# Altium project PCB_Project2.PrjPCB
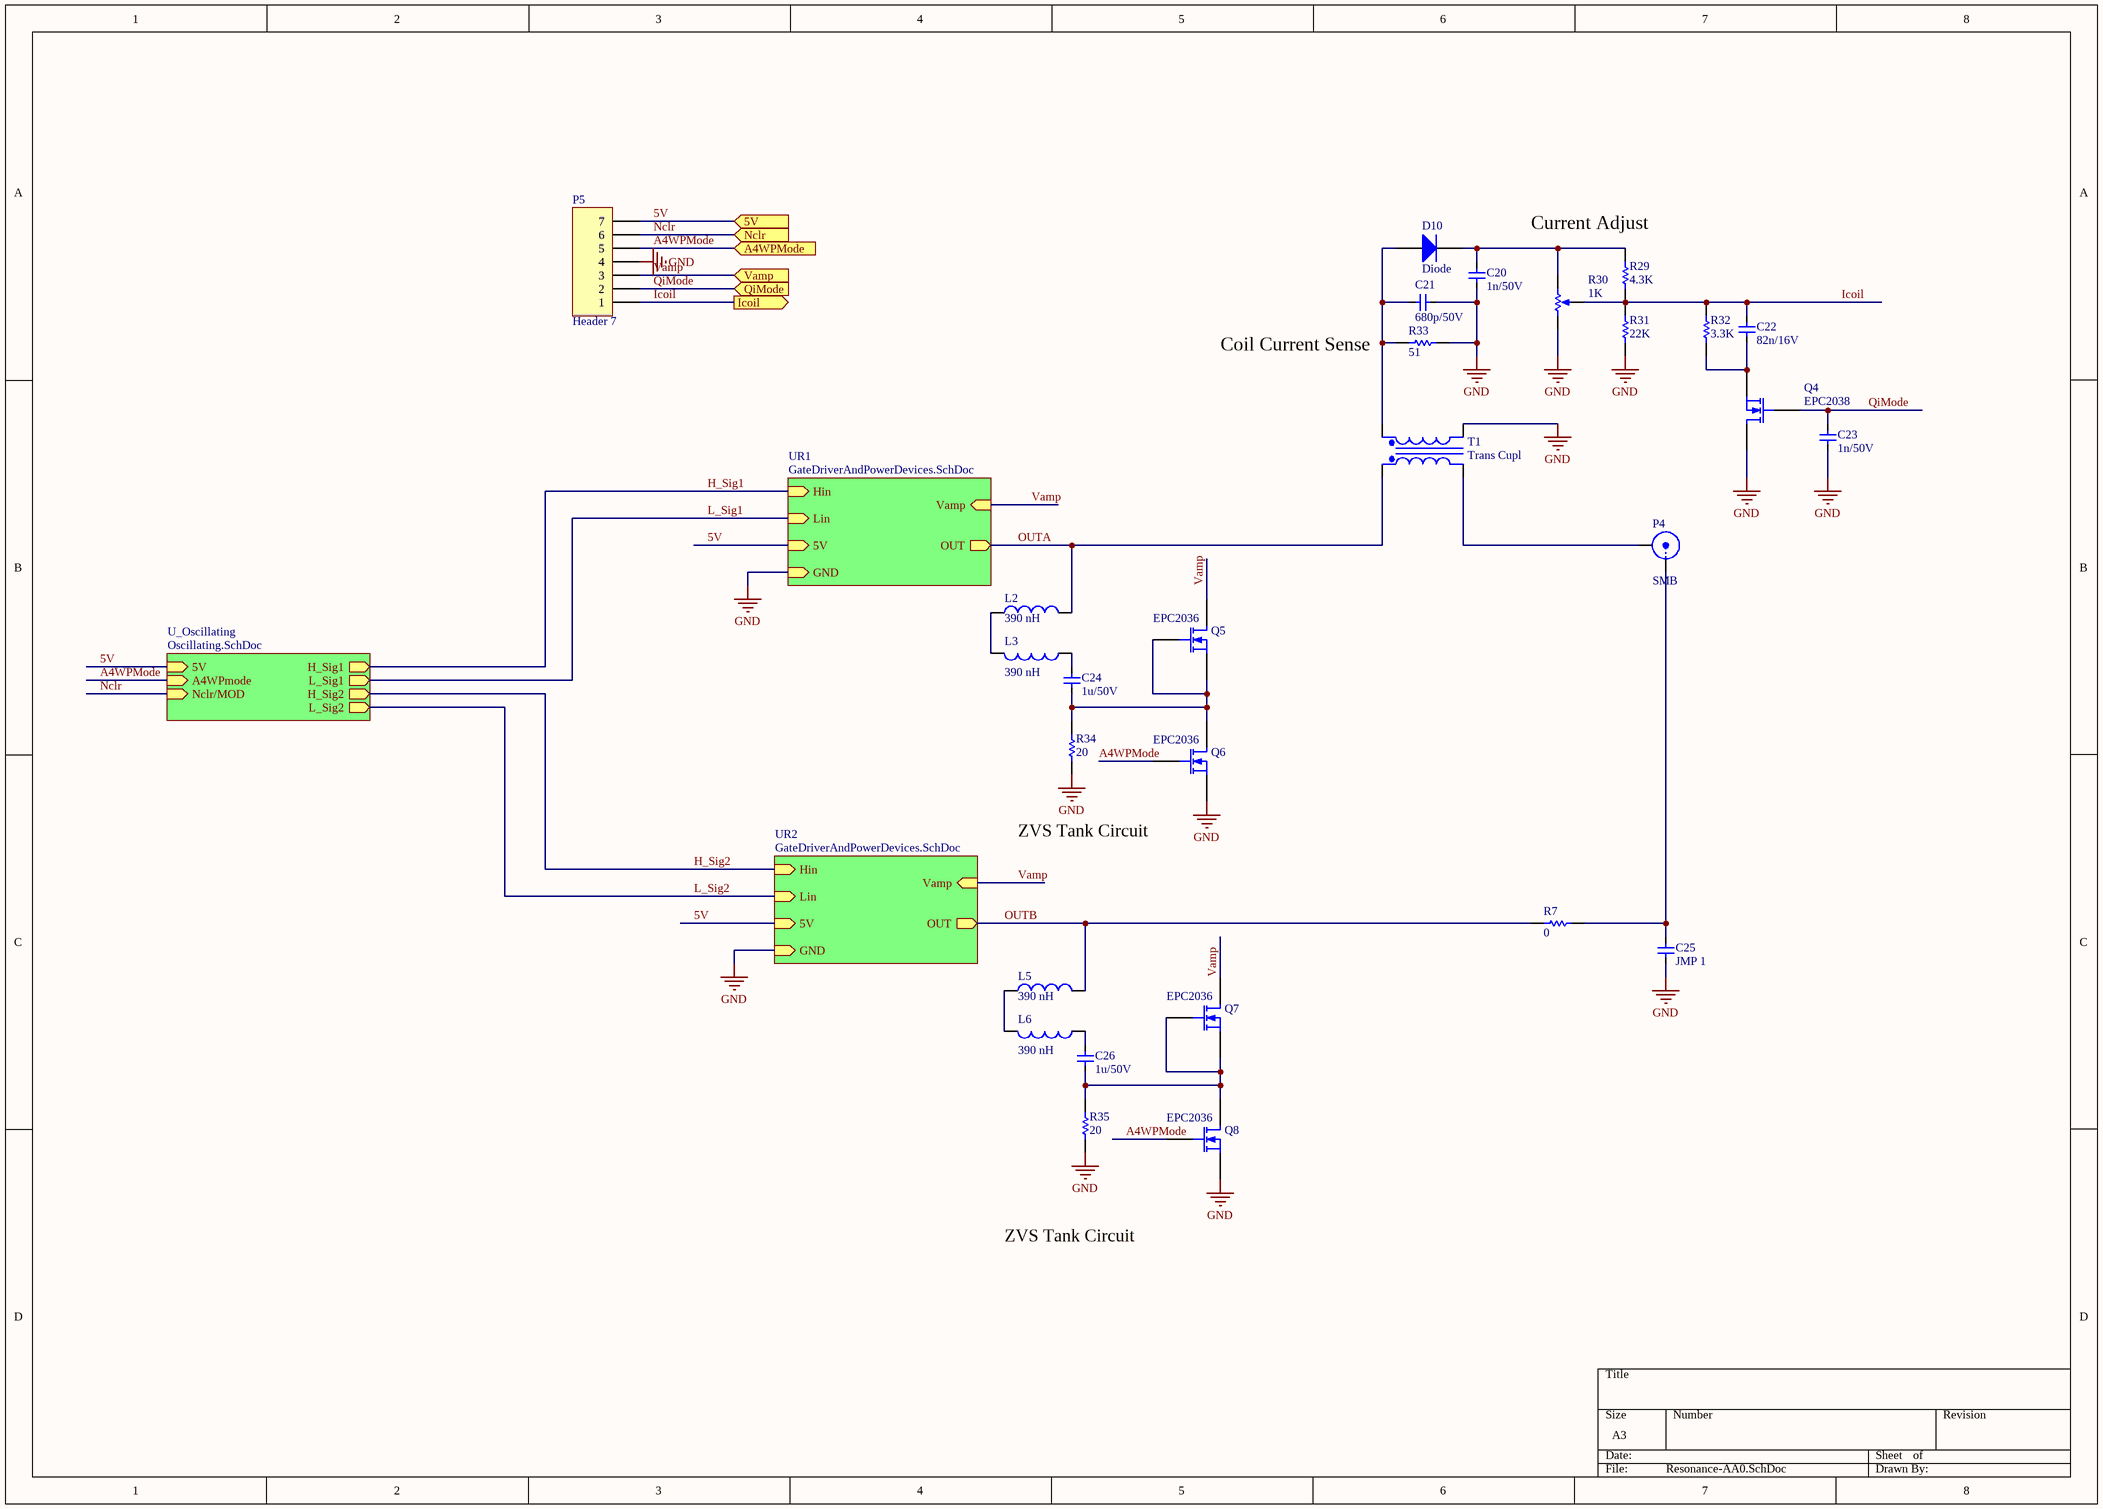
[diagram p0: Resonance-AA0.SchDoc]
8 sheets, 243 parts. Net scope: hierarchical (ports join the sheet entries above them; power ports are global).
Board file: A4WP-PCB.PcbDoc
Sheets:
  Resonance-AA0.SchDoc
    UR1 = GateDriverAndPowerDevices.SchDoc
    UR2 = GateDriverAndPowerDevices.SchDoc
    U_Oscillating = Oscillating.SchDoc
  top.SchDoc
    U_PowerSupport = PowerSupport.SchDoc
    U_ControlManage = ControlManage.SchDoc
    U_ControlPower = ControlPower.SchDoc
  MeasurevoltageCurrent .SchDoc

## Sheet Resonance-AA0.SchDoc
size A3

### Parts
(Parts that share a designator on the sheet are numbered #1, #2 ... from top to bottom, then left to right.)
C20  1n/50V  [0603]
C21  680p/50V  [0603]
C22  82n/16V  [0603]
C23  1n/50V  [0603]
C24  1u/50V  [0603]
C25#1  JMP 1  [0603]
C26#1  1u/50V  [0603]
D10#1  Diode  [SMA]
L2#1  value 390 nH  [INDP12274X23N]  (hidden comment: Inductor)
L3  value 390 nH  [INDP12274X23N]  (hidden comment: Inductor)
L5  value 390 nH  [INDP12274X23N]  (hidden comment: Inductor)
L6  value 390 nH  [INDP12274X23N]  (hidden comment: Inductor)
P4  SMB  [CONSMA003.062]
P5  Header 7  [HDR1X7]
Q4  EPC2038  [BGA100P9X9-81A]
Q5#1  EPC2036  [BGA100P9X9-81A]
Q6#1  EPC2036  [BGA100P9X9-81A]
Q7#1  EPC2036  [BGA100P9X9-81A]
Q8  EPC2036  [BGA100P9X9-81A]
R7#1  value 0  [0603]  (hidden comment: Res1)
R29  value 4.3K  [0603]  (hidden comment: Res1)
R30  value 1K  [VR5]  (hidden comment: RPot)
R31  value 22K  [0603]  (hidden comment: Res1)
R32  value 3.3K  [0603]  (hidden comment: Res1)
R33  value 51  [0603]  (hidden comment: Res1)
R34#1  value 20  [0603]  (hidden comment: Res1)
R35#1  value 20  [0603]  (hidden comment: Res1)
T1#1  Trans Cupl  [SOIC127P590X175-4N]

### Sub-sheets
U_Oscillating = Oscillating.SchDoc: 5V (in), H_Sig1 (out), L_Sig1 (out), H_Sig2 (out), L_Sig2 (out), A4WPmode (in), Nclr/MOD (in)
UR1 = GateDriverAndPowerDevices.SchDoc: 5V (in), OUT (out), Hin (in), Lin (in), GND (in), Vamp (in)
UR2 = GateDriverAndPowerDevices.SchDoc: 5V (in), OUT (out), Hin (in), Lin (in), GND (in), Vamp (in)

### Ports
5V (in), A4WPMode (in), Icoil (out), Nclr (in), QiMode (in), Vamp (in)

### Nets
GND: C20.1 C21.2 C23.1 C25#1.2 P5.4 Q4.1(D) Q6#1.3(S) Q8.3(S) R30.1(TOP) R31.2 R33.1 R34#1.1 R35#1.1 T1#1.2(Pri-) ; sheet UR1/GND, sheet UR2/GND
5V: P5.7 ; port 5V, sheet UR1/5V, sheet UR2/5V, sheet U_Oscillating/5V
A4WPMode: P5.5 Q6#1.2(G) Q8.2(G) ; port A4WPMode, sheet U_Oscillating/A4WPmode
H_Sig1: sheet UR1/Hin, sheet U_Oscillating/H_Sig1
H_Sig2: sheet UR2/Hin, sheet U_Oscillating/H_Sig2
Icoil: C22.2 P5.1 R29.2 R30.3(TAP) R31.1 R32.1 ; port Icoil
L_Sig1: sheet UR1/Lin, sheet U_Oscillating/L_Sig1
L_Sig2: sheet UR2/Lin, sheet U_Oscillating/L_Sig2
Nclr: P5.6 ; port Nclr, sheet U_Oscillating/Nclr/MOD
OUTA: L2#1.2 T1#1.3(Sec+) ; sheet UR1/OUT  [project net OUT]
OUTB: L5.2 R7#1.1 ; sheet UR2/OUT  [project net OUT]
QiMode: C23.2 P5.2 Q4.2(G) ; port QiMode
Vamp: P5.3 Q5#1.1(D) Q7#1.1(D) ; port Vamp, sheet UR1/Vamp, sheet UR2/Vamp
NetC20_2: C20.2 D10#1.2(K) R29.1 R30.2(BOT)
NetC21_1: C21.1 D10#1.1(A) R33.2 T1#1.1(Pri+)
NetC22_1: C22.1 Q4.3(S) R32.2
NetC24_1: C24.1 L3.1
NetC24_2: C24.2 Q5#1.2(G) Q5#1.3(S) Q6#1.1(D) R34#1.2
NetC25#1_1: C25#1.1 P4.1(X) R7#1.2
NetC26#1_1: C26#1.1 L6.1
NetC26#1_2: C26#1.2 Q7#1.2(G) Q7#1.3(S) Q8.1(D) R35#1.2
NetL2#1_1: L2#1.1 L3.2
NetL5_1: L5.1 L6.2
NetP4_2: P4.2(Y) T1#1.4(Sec-)

### Notes on the sheet
- (near R29) Current Adjust
- (near R33) Coil Current Sense
- ZVS Tank Circuit

### Library data of the parts
C20-C24 C25#1 C26#1 = CAP1: Capacitor
D10#1 = Diode: Default Diode; Published: 8-Jun-2000; LatestRevisionDate: 17-Jul-2002; LatestRevisionNote: Re-released for DXP Platform.; PackageVersion: Sep-1996; PackageReference: SMC; Publisher: Altium Limited; PackageDescription: DO-214-AB/SMC; 2 C-Bend Leads; Body 7.9 x 5.9 mm, inc. leads (LxW); Code_JEDEC: DO-214-AB
L2#1 L3 L5 L6 = Inductor: Code_IEC: 1005; Published: 8-Jun-2000; LatestRevisionDate: 29-May-2009; LatestRevisionNote: IPC-7351 Footprint Added.; PackageReference: 0402-A; Publisher: Altium Limited; PackageDescription: Chip Inductor; Code_JEITA: 0402
P4 = SMB: SMB Straight Connector; LatestRevisionDate: 17-Jul-2002; LatestRevisionNote: Re-released for DXP Platform.; Publisher: Altium Limited
P5 = Header 7: Header, 7-Pin; LatestRevisionDate: 17-Jul-2002; LatestRevisionNote: Re-released for DXP Platform.; Publisher: Altium Limited
Q4 Q5#1 Q6#1 Q7#1 Q8 = MOSFET-N: N-Channel MOSFET; Published: 8-Jun-2000; LatestRevisionDate: 17-Jul-2002; LatestRevisionNote: Re-released for DXP Platform.; PackageVersion: 1995/1996; PackageReference: E3; Publisher: Altium Limited; PackageDescription: TO, Flat Index; 3 In-Line, Axial Leads; Body Dia. 4.6mm; Lead Dia. 0.5 mm (max)
R7#1 R29 R31-R33 R34#1 R35#1 = Res1: Resistor; Published: 8-Jun-2000; LatestRevisionDate: 17-Jul-2002; LatestRevisionNote: Re-released for DXP Platform.; PackageReference: AXIAL-0.3; Publisher: Altium Limited; PackageDescription: Axial Device, Thru-Hole; 2 Leads; 0.3 in Pin Spacing
R30 = RPot: Potentiometer; Sim Note: Enter the Resistance value and the set point into parameter fields.; Set Position: 0.5; Published: 8-Jun-2000; LatestRevisionDate: 17-Jul-2002; LatestRevisionNote: Re-released for DXP Platform.; PackageReference: VR5; Publisher: Altium Limited; PackageDescription: Variable Resistor, Thru-Hole; 3 Leads
T1#1 = Trans Cupl: Transformer (Coupled Inductor Model); Published: 8-Jun-2000; LatestRevisionDate: 17-Jul-2002; LatestRevisionNote: Re-released for DXP Platform.; PackageReference: TRF_4; Publisher: Altium Limited; PackageDescription: Transformer; 4 Leads

## Sheet GateDriverAndPowerDevices.SchDoc: Gate driver and power devices schematic
size A4
Used 2 times, as channels UR1, UR2. Parts and nets are listed once, with the designators drawn on the sheet.
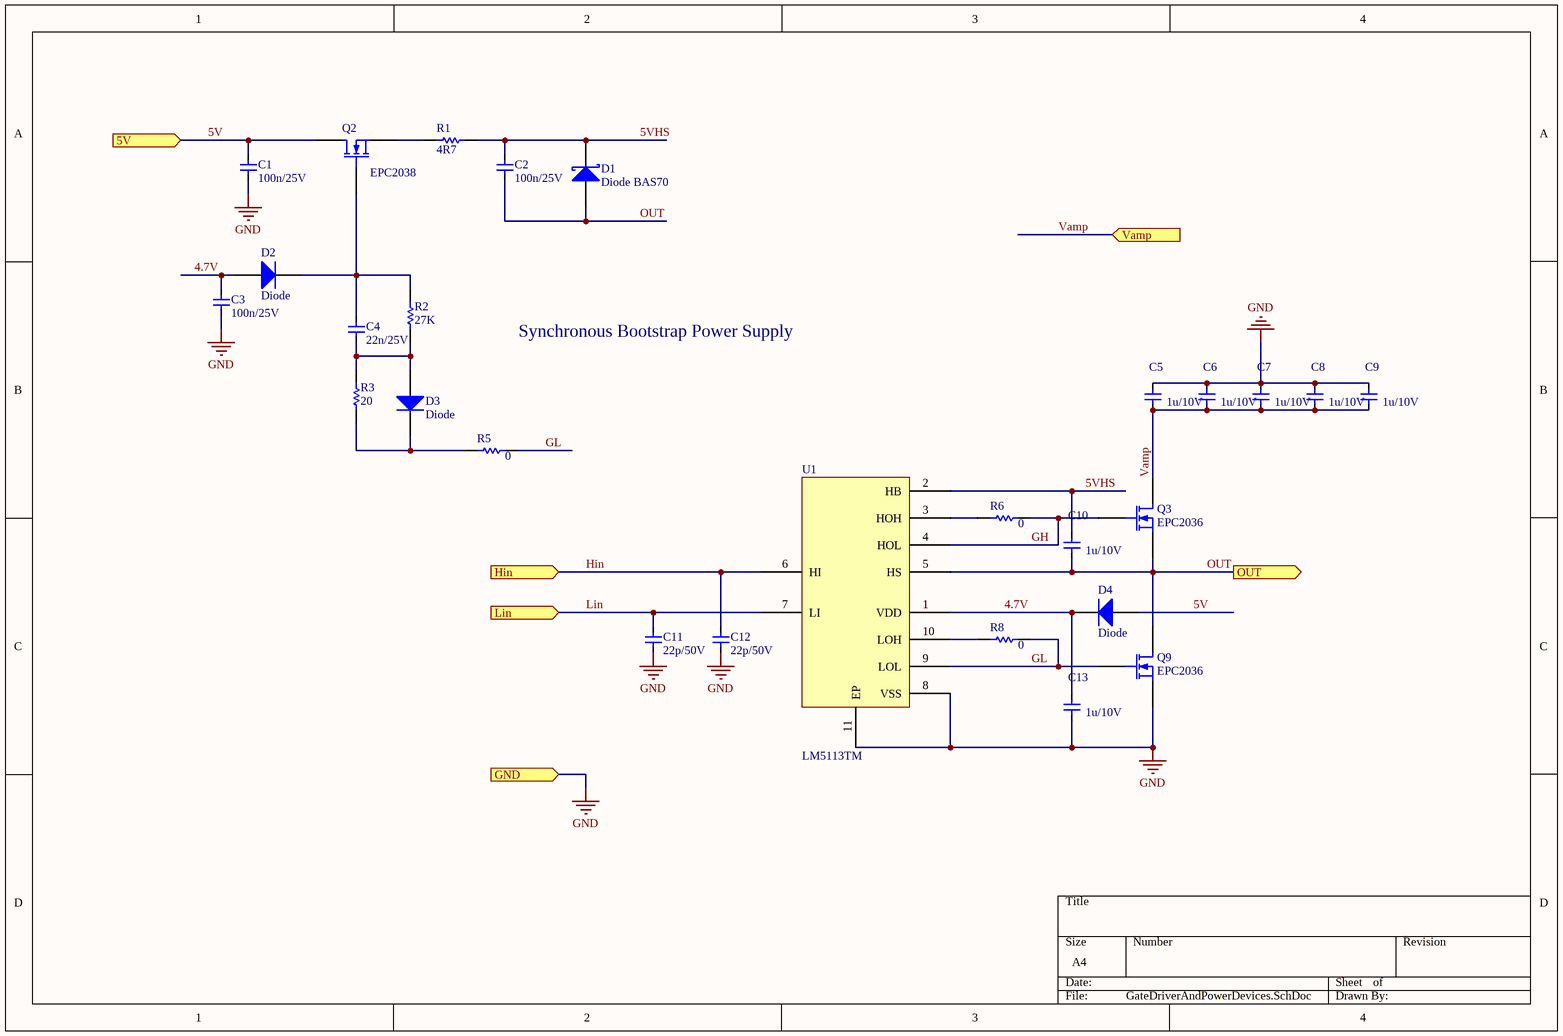
[diagram p1: GateDriverAndPowerDevices.SchDoc]

### Parts
C1  100n/25V  [0603]
C2  100n/25V  [0603]
C3  100n/25V  [0603]
C4  22n/25V  [0603]
C5  1u/10V  [0603]
C6  1u/10V  [0603]
C7  1u/10V  [0603]
C8  1u/10V  [0603]
C9  1u/10V  [0603]
C10  1u/10V  [0603]
C11  22p/50V  [0603]
C12  22p/50V  [0603]
C13  1u/10V  [0603]
D1  Diode BAS70  [SMA]
D2  Diode  [SMA]
D3  Diode  [SMA]
D4  Diode  [SMA]
Q2  EPC2038  [BGA100P9X9-81A]
Q3  EPC2036  [BGA100P9X9-81A]
Q9  EPC2036  [BGA100P9X9-81A]
R1  value 4R7  [0603]  (hidden comment: Res1)
R2  value 27K  [0603]  (hidden comment: Res1)
R3  value 20  [0603]  (hidden comment: Res1)
R5  value 0  [0603]  (hidden comment: Res1)
R6  value 0  [0402]  (hidden comment: Res1)
R8  value 0  [0402]  (hidden comment: Res1)
U1  LM5113TM  [QFN80P400X400X80-10N]

### Ports
5V (in), GND (in), Hin (in), Lin (in), OUT (out), Vamp (in)

### Nets
GND: C1.2 C3.2 C5.1 C6.1 C7.1 C8.1 C9.1 C11.2 C12.2 C13.2 Q9.3(S) U1.8(VSS) U1.11(EP) ; port GND
4.7V: C3.1 C13.1 D2.1(A) D4.2(K) U1.1(VDD)
5V: C1.1 D4.1(A) Q2.1(D) ; port 5V
5VHS: C2.1 C10.1 D1.3(K) R1.1 U1.2(HB)
GH: Q3.2(G) R6.2 U1.4(HOL)
GL: Q9.2(G) R5.2 R8.2 U1.9(LOL)
Hin: C12.1 U1.6(HI) ; port Hin
Lin: C11.1 U1.7(LI) ; port Lin
OUT: C2.2 C10.2 D1.1(A) Q3.3(S) Q9.1(D) U1.5(HS) ; port OUT
Vamp: C5.2 C6.2 C7.2 C8.2 C9.2 Q3.1(D) ; port Vamp
NetC4_1: C4.1 D2.2(K) Q2.2(G) R2.2
NetC4_2: C4.2 D3.1(A) R2.1 R3.2
NetD3_2: D3.2(K) R3.1 R5.1
NetQ2_3: Q2.3(S) R1.2
NetR6_1: R6.1 U1.3(HOH)
NetR8_1: R8.1 U1.10(LOH)

### Channels
UR1: designators end in _UR1; ports 5V=5V GND=GND Hin=H_Sig1 Lin=L_Sig1 OUT=OUT Vamp=Vamp
UR2: designators end in _UR2; ports 5V=5V GND=GND Hin=H_Sig2 Lin=L_Sig2 OUT=OUT Vamp=Vamp

### Notes on the sheet
- Synchronous Bootstrap Power Supply

### Library data of the parts
C1-C13 = CAP1: Capacitor
D1 = Diode BAS70: Silicon AF Schottky Diode for High-Speed Switching; pin to pad: 3>2; Note: Pin 2 is not connected and not drawn.; Published: 21-Mar-2003; LatestRevisionDate: 29-May-2009; LatestRevisionNote: IPC-7351 Footprint Added.; DatasheetVersion: Oct-1999; PackageVersion: Sep-2001; PackageReference: SOT-23; Publisher: Altium Limited; PackageDescription: 3-Pin SOT-23 Package 0.95 mm Pitch, 2.5 mm Lead Span; ComponentLink1Description: Manufacturer Link; ComponentLink1URL: http://www.infineon.com/; ComponentLink2Description: Datasheet; ComponentLink2URL: http://www.infineon.com/upload/Document/cmc_upload/documents/009/382/bas40_bas140series_1.pdf
D2-D4 = Diode: Default Diode; Published: 8-Jun-2000; LatestRevisionDate: 17-Jul-2002; LatestRevisionNote: Re-released for DXP Platform.; PackageVersion: Sep-1996; PackageReference: SMC; Publisher: Altium Limited; PackageDescription: DO-214-AB/SMC; 2 C-Bend Leads; Body 7.9 x 5.9 mm, inc. leads (LxW); Code_JEDEC: DO-214-AB
Q2 Q3 Q9 = MOSFET-N: N-Channel MOSFET; Published: 8-Jun-2000; LatestRevisionDate: 17-Jul-2002; LatestRevisionNote: Re-released for DXP Platform.; PackageVersion: 1995/1996; PackageReference: E3; Publisher: Altium Limited; PackageDescription: TO, Flat Index; 3 In-Line, Axial Leads; Body Dia. 4.6mm; Lead Dia. 0.5 mm (max)
R1-R3 R5 R6 R8 = Res1: Resistor; Published: 8-Jun-2000; LatestRevisionDate: 17-Jul-2002; LatestRevisionNote: Re-released for DXP Platform.; PackageReference: AXIAL-0.3; Publisher: Altium Limited; PackageDescription: Axial Device, Thru-Hole; 2 Leads; 0.3 in Pin Spacing

## Sheet Oscillating.SchDoc
size A3
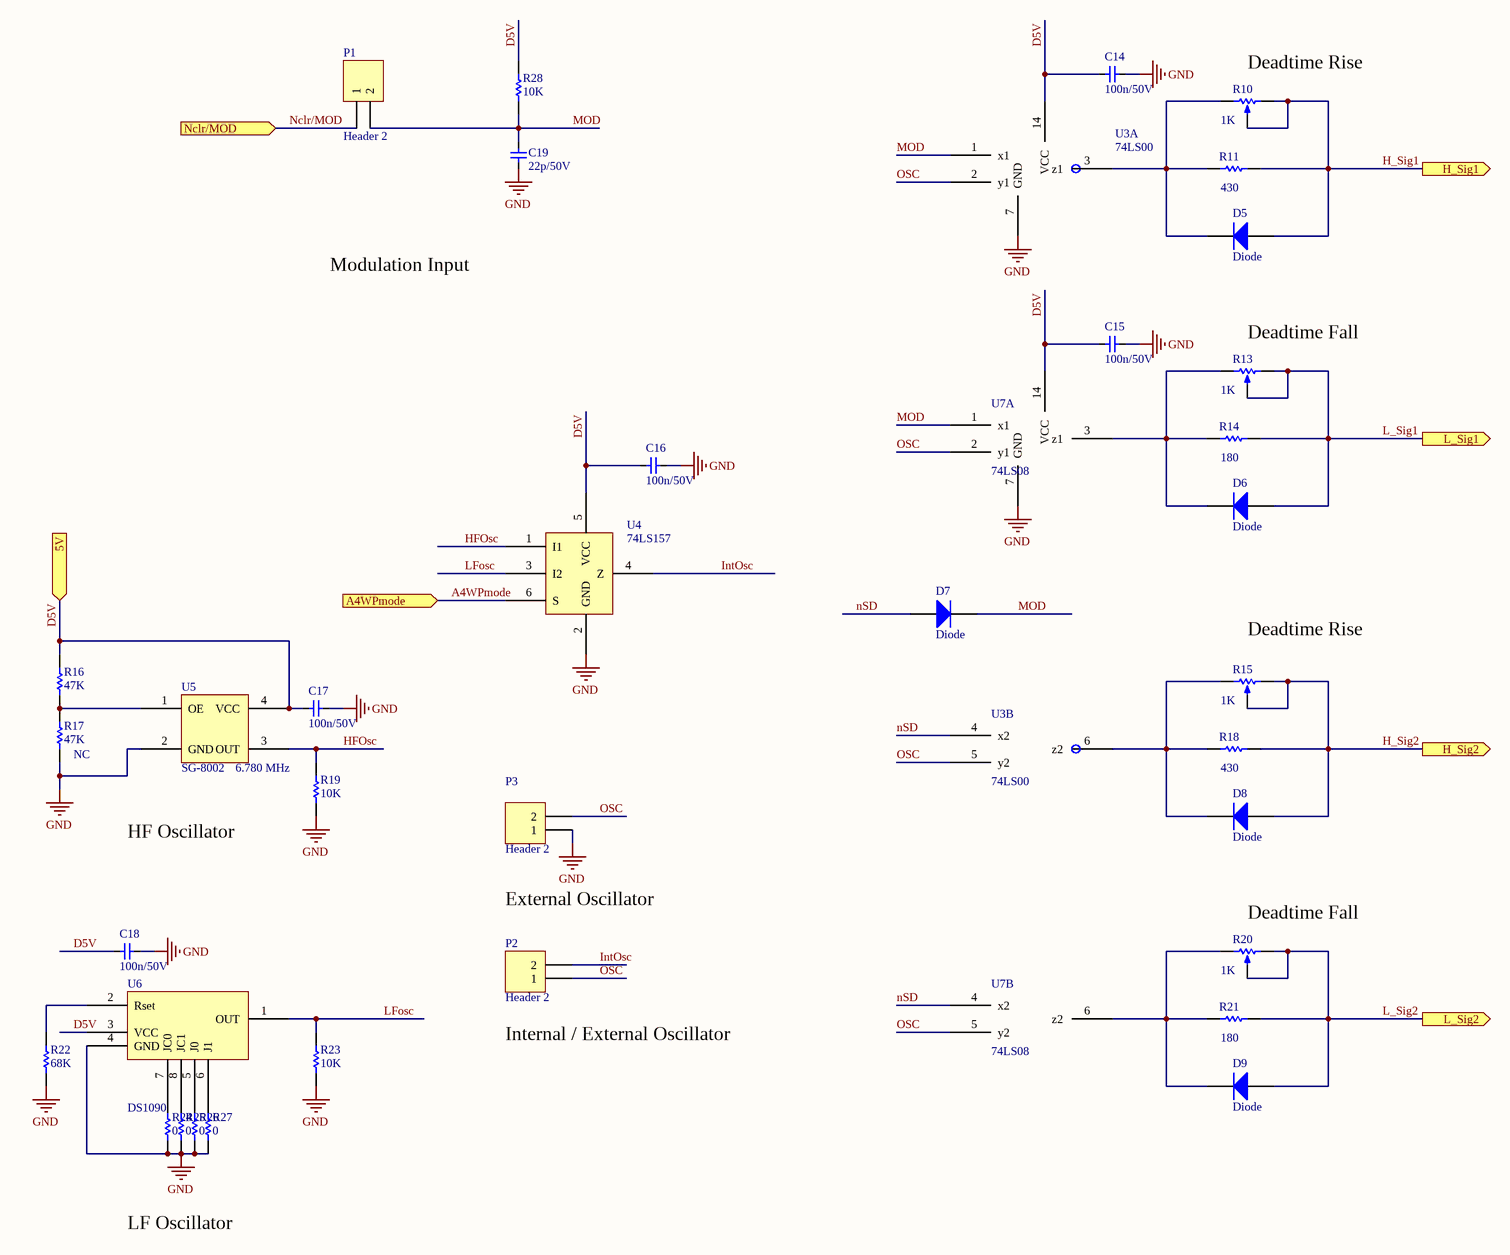
[diagram p2: Oscillating.SchDoc]

### Parts
(Parts that share a designator on the sheet are numbered #1, #2 ... from top to bottom, then left to right.)
C14  100n/50V  [0603]
C15  100n/50V  [0603]
C16  100n/50V  [0603]
C17  100n/50V  [0603]
C18  100n/50V  [0603]
C19  22p/50V  [0603]
D5#1  Diode  [SMA]
D6#1  Diode  [SMA]
D7#1  Diode  [SMA]
D8#1  Diode  [SMA]
D9#1  Diode  [SMA]
P1#1  Header 2  [HDR1X2]
P2#1  Header 2  [HDR1X2]
P3  Header 2  [HDR1X2]
R10#1  value 1K  [VR5]  (hidden comment: RPot)
R11#1  value 430  [0603]
R13#1  value 1K  [VR5]  (hidden comment: RPot)
R14#1  value 180  [0603]
R15#1  value 1K  [VR5]  (hidden comment: RPot)
R16#1  value 47K  [0603]  (hidden comment: Res1)
R17#1  NC  value 47K  [0603]
R18#1  value 430  [0603]
R19#1  value 10K  [0603]  (hidden comment: Res1)
R20#1  value 1K  [VR5]  (hidden comment: RPot)
R21#1  value 180  [0603]
R22#1  value 68K  [0603]
R23#1  value 10K  [0603]  (hidden comment: Res1)
R24#1  value 0  [0603]
R25  value 0  [0603]
R26  value 0  [0603]
R27  value 0  [0603]
R28  value 10K  [0603]  (hidden comment: Res1)
U3#1  74LS00  [SO-14]  (parts A,B of 4)
U4  74LS157  [TSOP65P220X100-6N]
U5#1  SG-8002  value 6.780 MHz  [SOT192P240X120-4N]
U6#1  DS1090  [TSOP65P490X100-8N]
U7  74LS08  [SO-14]  (parts A,B of 4)

### Ports
5V (in), A4WPmode (in), H_Sig1 (out), H_Sig2 (out), L_Sig1 (out), L_Sig2 (out), Nclr/MOD (in)

### Nets
GND: C14.1 C15.1 C16.1 C17.1 C18.1 C19.2 P3.1 R17#1.1 R19#1.1 R22#1.1 R23#1.1 R24#1.1 R25.1 R26.1 R27.1 U3#1.7(GND) U4.2(GND) U5#1.2(GND) U6#1.4(GND) U7.7(GND)
A4WPMode: U4.6(S) ; port A4WPmode
D5V: C14.2 C15.2 C16.2 C17.2 C18.2 R16#1.2 R28.2 U3#1.14(VCC) U4.5(VCC) U5#1.4(VCC) U6#1.3(VCC) U7.14(VCC) ; port 5V  [project net 5V]
H_Sig1: D5#1.1(A) R10#1.2(BOT) R10#1.3(TAP) R11#1.1 ; port H_Sig1
H_Sig2: D8#1.1(A) R15#1.2(BOT) R15#1.3(TAP) R18#1.1 ; port H_Sig2
HFOsc: R19#1.2 U4.1(I1) U5#1.3(OUT)
IntOsc: P2#1.2 U4.4(Z)
L_Sig1: D6#1.1(A) R13#1.2(BOT) R13#1.3(TAP) R14#1.1 ; port L_Sig1
L_Sig2: D9#1.1(A) R20#1.2(BOT) R20#1.3(TAP) R21#1.1 ; port L_Sig2
LFosc: R23#1.2 U4.3(I2) U6#1.1(OUT)
MOD: C19.1 D7#1.2(K) P1#1.2 R28.1 U3#1.1(x1) U7.1(x1)
Nclr/MOD: P1#1.1 ; port Nclr/MOD  [project net Nclr]
nSD: D7#1.1(A) U3#1.4(x2) U7.4(x2)
OSC: P2#1.1 P3.2 U3#1.2(y1) U3#1.5(y2) U7.2(y1) U7.5(y2)
NetD5#1_2: D5#1.2(K) R10#1.1(TOP) R11#1.2 U3#1.3(z1)
NetD6#1_2: D6#1.2(K) R13#1.1(TOP) R14#1.2 U7.3(z1)
NetD8#1_2: D8#1.2(K) R15#1.1(TOP) R18#1.2 U3#1.6(z2)
NetD9#1_2: D9#1.2(K) R20#1.1(TOP) R21#1.2 U7.6(z2)
NetR16#1_1: R16#1.1 R17#1.2 U5#1.1(OE)
NetR22#1_2: R22#1.2 U6#1.2(Rset)
NetR24#1_2: R24#1.2 U6#1.7(JC0)
NetR25_2: R25.2 U6#1.8(JC1)
NetR26_2: R26.2 U6#1.5(J0)
NetR27_2: R27.2 U6#1.6(J1)

### Notes on the sheet
- (near R10#1) Deadtime Rise
- Modulation Input
- (near R13#1) Deadtime Fall
- (near R15#1) Deadtime Rise
- HF Oscillator
- External Oscillator
- (near R20#1) Deadtime Fall
- (near P2#1) Internal / External Oscillator
- LF Oscillator

### Library data of the parts
C14-C19 = CAP1: Capacitor
D5#1 D6#1 D7#1 D8#1 D9#1 = Diode: Default Diode; Published: 8-Jun-2000; LatestRevisionDate: 17-Jul-2002; LatestRevisionNote: Re-released for DXP Platform.; PackageVersion: Sep-1996; PackageReference: SMC; Publisher: Altium Limited; PackageDescription: DO-214-AB/SMC; 2 C-Bend Leads; Body 7.9 x 5.9 mm, inc. leads (LxW); Code_JEDEC: DO-214-AB
P1#1 P2#1 P3 = Header 2: Header, 2-Pin; LatestRevisionDate: 17-Jul-2002; LatestRevisionNote: Re-released for DXP Platform.; Publisher: Altium Limited
R10#1 R13#1 R15#1 R20#1 = RPot: as R30 on sheet Resonance-AA0; Published: 8-Jun-2000; LatestRevisionDate: 17-Jul-2002; LatestRevisionNote: Re-released for DXP Platform.; PackageReference: VR5; Publisher: Altium Limited; PackageDescription: Variable Resistor, Thru-Hole; 3 Leads
R11#1 R14#1 R16#1 R17#1 R18#1 R19#1 R21#1 R22#1 R23#1 R24#1 R25-R28 = Res1: Resistor; Published: 8-Jun-2000; LatestRevisionDate: 17-Jul-2002; LatestRevisionNote: Re-released for DXP Platform.; PackageReference: AXIAL-0.3; Publisher: Altium Limited; PackageDescription: Axial Device, Thru-Hole; 2 Leads; 0.3 in Pin Spacing

## Sheet top.SchDoc
size A4
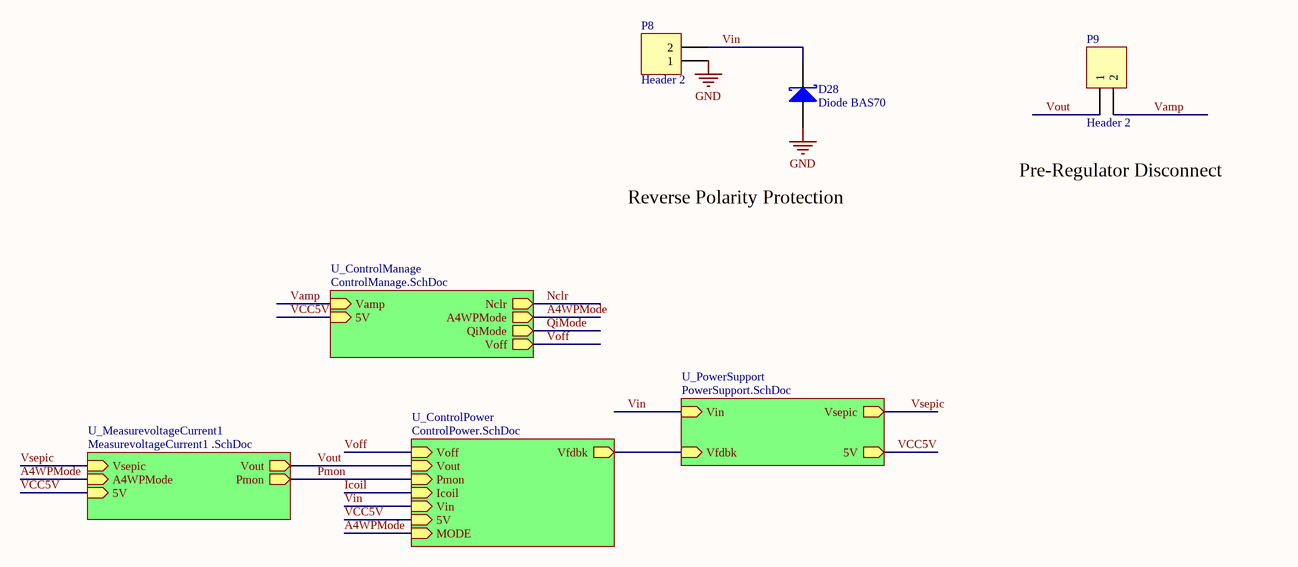
[diagram p3: top.SchDoc]

### Parts
D28  Diode BAS70  [SMA]
P8  Header 2  [HDR1X2]
P9  Header 2  [HDR1X2]

### Sub-sheets
U_ControlManage = ControlManage.SchDoc: Nclr (out), Vamp (in), A4WPMode (out), QiMode (out), 5V (in), Voff (out)
U_ControlPower = ControlPower.SchDoc: Voff (in), Vout (in), Pmon (in), Icoil (in), Vfdbk (out), Vin (in), 5V (in), MODE (in)
U_MeasurevoltageCurrent1  = MeasurevoltageCurrent1 .SchDoc (file not in this document): Vout (out), Vsepic (in), A4WPMode (in), Pmon (out), 5V (in)
U_PowerSupport = PowerSupport.SchDoc: Vsepic (out), 5V (out), Vin (in), Vfdbk (in)

### Nets
GND: D28.1(A) P8.1
VCC5V: sheet U_PowerSupport/5V, sheet U_ControlManage/5V, sheet U_ControlPower/5V, sheet U_MeasurevoltageCurrent1 /5V  [project net 5V]
A4WPMode: sheet U_ControlManage/A4WPMode, sheet U_ControlPower/MODE, sheet U_MeasurevoltageCurrent1 /A4WPMode
Pmon: sheet U_ControlPower/Pmon, sheet U_MeasurevoltageCurrent1 /Pmon
Vamp: P9.2 ; sheet U_ControlManage/Vamp
Vfdbk: sheet U_PowerSupport/Vfdbk, sheet U_ControlPower/Vfdbk
Vin: D28.3(K) P8.2 ; sheet U_PowerSupport/Vin, sheet U_ControlPower/Vin
Voff: sheet U_ControlManage/Voff, sheet U_ControlPower/Voff
Vout: P9.1 ; sheet U_ControlPower/Vout, sheet U_MeasurevoltageCurrent1 /Vout
Vsepic: sheet U_PowerSupport/Vsepic, sheet U_MeasurevoltageCurrent1 /Vsepic

### Notes on the sheet
- Pre-Regulator Disconnect
- Reverse Polarity Protection

### Library data of the parts
D28 = Diode BAS70: Silicon AF Schottky Diode for High-Speed Switching; pin to pad: 3>2; Note: Pin 2 is not connected and not drawn.; Published: 21-Mar-2003; LatestRevisionDate: 29-May-2009; LatestRevisionNote: IPC-7351 Footprint Added.; DatasheetVersion: Oct-1999; PackageVersion: Sep-2001; PackageReference: SOT-23; Publisher: Altium Limited; PackageDescription: 3-Pin SOT-23 Package 0.95 mm Pitch, 2.5 mm Lead Span; ComponentLink1Description: Manufacturer Link; ComponentLink1URL: http://www.infineon.com/; ComponentLink2Description: Datasheet; ComponentLink2URL: http://www.infineon.com/upload/Document/cmc_upload/documents/009/382/bas40_bas140series_1.pdf
P8 P9 = Header 2: Header, 2-Pin; LatestRevisionDate: 17-Jul-2002; LatestRevisionNote: Re-released for DXP Platform.; Publisher: Altium Limited

## Sheet PowerSupport.SchDoc
size A3
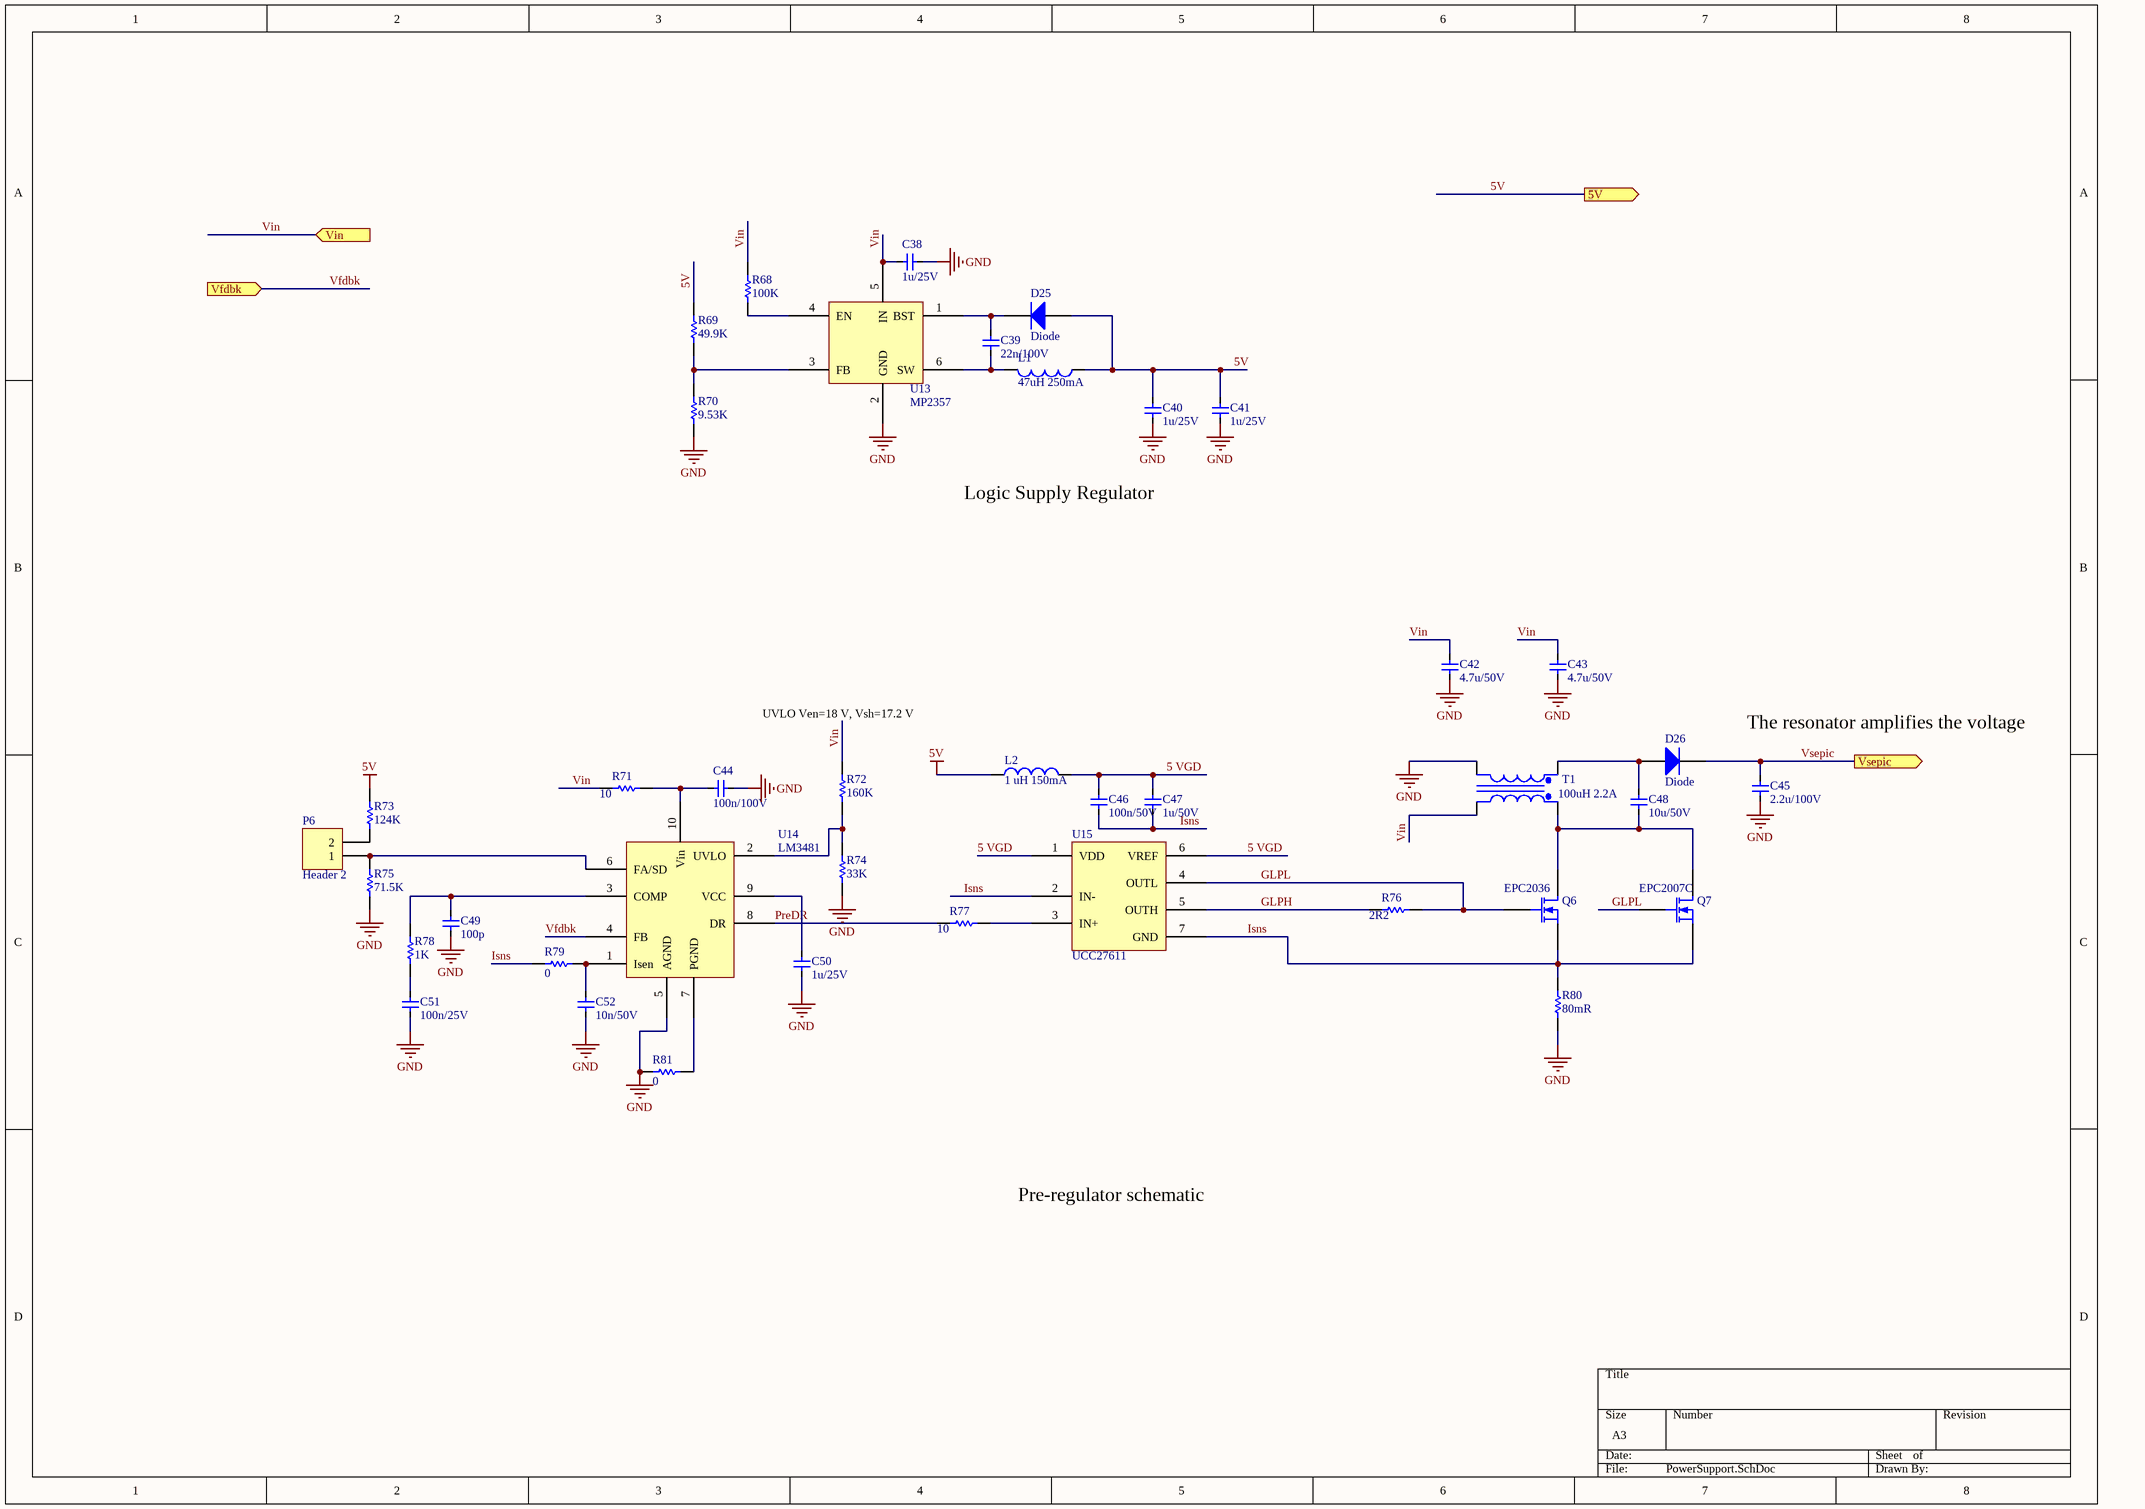
[diagram p4: PowerSupport.SchDoc]

### Parts
(Parts that share a designator on the sheet are numbered #1, #2 ... from top to bottom, then left to right.)
C38  1u/25V  [0603]
C39  22n/100V  [0603]
C40  1u/25V  [0603]
C41  1u/25V  [0603]
C42  4.7u/50V  [0603]
C43  4.7u/50V  [0603]
C44  100n/100V  [0603]
C45  2.2u/100V  [0603]
C46  100n/50V  [0603]
C47  1u/50V  [0603]
C48  10u/50V  [0603]
C49  100p  [0603]
C50  1u/25V  [0603]
C51  100n/25V  [0603]
C52  10n/50V  [0603]
D25  Diode  [SMA]
D26  Diode  [SMA]
L1  value 47uH 250mA  [0402-A]  (hidden comment: Inductor)
L2#2  value 1 uH 150mA  [0402-A]  (hidden comment: Inductor)
P6  Header 2  [HDR1X2]
Q6#2  EPC2036  [BGA100P9X9-81A]
Q7#2  EPC2007C  [BGA100P9X9-81A]
R68  value 100K  [0603]  (hidden comment: Res1)
R69  value 49.9K  [0603]  (hidden comment: Res1)
R70  value 9.53K  [0603]  (hidden comment: Res1)
R71  value 10  [0603]  (hidden comment: Res1)
R72  value 160K  [0603]  (hidden comment: Res1)
R73  value 124K  [0603]  (hidden comment: Res1)
R74  value 33K  [0603]  (hidden comment: Res1)
R75  value 71.5K  [0603]  (hidden comment: Res1)
R76  value 2R2  [0603]  (hidden comment: Res1)
R77  value 10  [0603]  (hidden comment: Res1)
R78  value 1K  [0603]  (hidden comment: Res1)
R79  value 0  [0603]  (hidden comment: Res1)
R80  value 80mR  [0603]  (hidden comment: Res1)
R81  value 0  [0603]  (hidden comment: Res1)
T1#2  value 100uH 2.2A  [SOT830P245X1500-5N]  (hidden comment: Trans Cupl)
U13  MP2357  [SOT95P280X100-6N]
U14  LM3481  [TSSOP50P500X100-10N]
U15  UCC27611  [QFN65P250X200X80-6N]

### Ports
5V (out), Vfdbk (in), Vin (in), Vsepic (out)

### Nets
5V: C40.2 C41.2 D25.1(A) L1.1 L2#2.1 R69.1 R73.1 ; port 5V
GND: C38.2 C40.1 C41.1 C42.1 C43.1 C44.1 C45.1 C49.1 C50.2 C51.1 C52.1 R70.2 R74.1 R75.2 R80.1 R81.2 T1#2.2(Pri-) U13.2(GND) U14.5(AGND)
5 VGD: C46.2 C47.2 L2#2.2 U15.1(VDD) U15.6(VREF)
GLPH: R76.1 U15.5(OUTH)
GLPL: Q6#2.2(G) Q7#2.2(G) R76.2 U15.4(OUTL)
Isns: C46.1 C47.1 Q6#2.3(S) Q7#2.3(S) R79.2 R80.2 U15.2(IN-) U15.7(GND)
PreDR: R77.1 U14.8(DR)
Vfdbk: U14.4(FB) ; port Vfdbk
Vin: C38.1 C42.2 C43.2 R68.1 R71.1 R72.2 T1#2.4(Sec-) U13.5(IN) ; port Vin
Vsepic: C45.2 D26.2(K) ; port Vsepic
NetC39_1: C39.1 L1.2 U13.6(SW)
NetC39_2: C39.2 D25.2(K) U13.1(BST)
NetC44_2: C44.2 R71.2 U14.10(Vin)
NetC48_1: C48.1 Q6#2.1(D) Q7#2.1(D) T1#2.3(Sec+)
NetC48_2: C48.2 D26.1(A) T1#2.1(Pri+)
NetC49_2: C49.2 R78.2 U14.3(COMP)
NetC50_1: C50.1 U14.9(VCC)
NetC51_2: C51.2 R78.1
NetC52_2: C52.2 R79.1 U14.1(Isen)
NetP6_1: P6.1 R75.1 U14.6(FA/SD)
NetP6_2: P6.2 R73.2
NetR68_2: R68.2 U13.4(EN)
NetR69_2: R69.2 R70.1 U13.3(FB)
NetR72_1: R72.1 R74.2 U14.2(UVLO)
NetR77_2: R77.2 U15.3(IN+)
NetR81_1: R81.1 U14.7(PGND)

### Notes on the sheet
- Logic Supply Regulator
- UVLO Ven=18 V, Vsh=17.2 V
- The resonator amplifies the voltage
- Pre-regulator schematic

### Library data of the parts
C38-C52 = CAP1: Capacitor
D25 D26 = Diode: Default Diode; Published: 8-Jun-2000; LatestRevisionDate: 17-Jul-2002; LatestRevisionNote: Re-released for DXP Platform.; PackageVersion: Sep-1996; PackageReference: SMC; Publisher: Altium Limited; PackageDescription: DO-214-AB/SMC; 2 C-Bend Leads; Body 7.9 x 5.9 mm, inc. leads (LxW); Code_JEDEC: DO-214-AB
L1 L2#2 = Inductor: Code_IEC: 1005; Published: 8-Jun-2000; LatestRevisionDate: 29-May-2009; LatestRevisionNote: IPC-7351 Footprint Added.; PackageReference: 0402-A; Publisher: Altium Limited; PackageDescription: Chip Inductor; Code_JEITA: 0402
P6 = Header 2: Header, 2-Pin; LatestRevisionDate: 17-Jul-2002; LatestRevisionNote: Re-released for DXP Platform.; Publisher: Altium Limited
Q6#2 Q7#2 = MOSFET-N: N-Channel MOSFET; Published: 8-Jun-2000; LatestRevisionDate: 17-Jul-2002; LatestRevisionNote: Re-released for DXP Platform.; PackageVersion: 1995/1996; PackageReference: E3; Publisher: Altium Limited; PackageDescription: TO, Flat Index; 3 In-Line, Axial Leads; Body Dia. 4.6mm; Lead Dia. 0.5 mm (max)
R68-R81 = Res1: Resistor; Published: 8-Jun-2000; LatestRevisionDate: 17-Jul-2002; LatestRevisionNote: Re-released for DXP Platform.; PackageReference: AXIAL-0.3; Publisher: Altium Limited; PackageDescription: Axial Device, Thru-Hole; 2 Leads; 0.3 in Pin Spacing
T1#2 = Trans Cupl: Transformer (Coupled Inductor Model); Published: 8-Jun-2000; LatestRevisionDate: 17-Jul-2002; LatestRevisionNote: Re-released for DXP Platform.; PackageReference: TRF_4; Publisher: Altium Limited; PackageDescription: Transformer; 4 Leads

## Sheet ControlManage.SchDoc
size A4
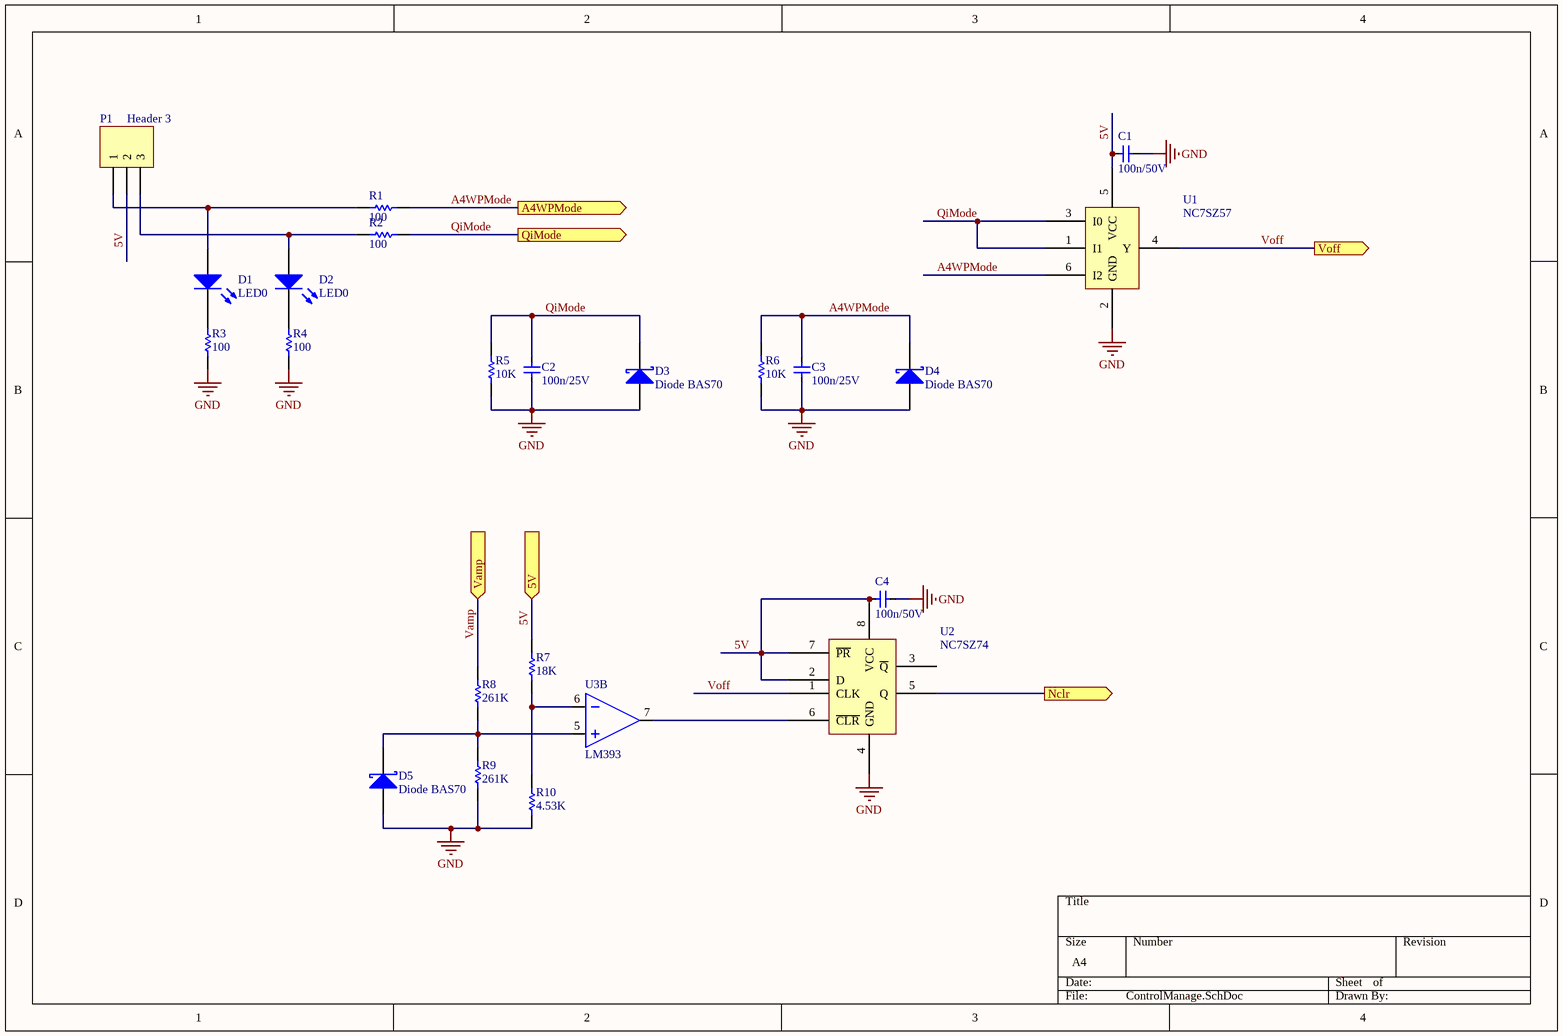
[diagram p5: ControlManage.SchDoc]

### Parts
(Parts that share a designator on the sheet are numbered #1, #2 ... from top to bottom, then left to right.)
C1  100n/50V  [0603]
C2  100n/25V  [0603]
C3  100n/25V  [0603]
C4  100n/50V  [0603]
D1  LED0  [LED0805]
D2  LED0  [LED0805]
D3  Diode BAS70  [SMA]
D4  Diode BAS70  [SMA]
D5#2  Diode BAS70  [SMA]
P1#2  Header 3  [HDR1X3]
R1  value 100  [0603]  (hidden comment: Res1)
R2  value 100  [0603]  (hidden comment: Res1)
R3  value 100  [0603]  (hidden comment: Res1)
R4  value 100  [0603]  (hidden comment: Res1)
R5  value 10K  [0603]  (hidden comment: Res1)
R6  value 10K  [0603]  (hidden comment: Res1)
R7#2  value 18K  [0603]  (hidden comment: Res1)
R8  value 261K  [0603]  (hidden comment: Res1)
R9  value 261K  [0603]  (hidden comment: Res1)
R10#2  value 4.53K  [0603]  (hidden comment: Res1)
U1  NC7SZ57  [TSOP65P220X100-6N]
U2  NC7SZ74  [TSSOP50P340X100-8N]
U3#2  LM393  [SO8_L]  (part B of 2)

### Ports
5V (in), A4WPMode (out), Nclr (out), QiMode (out), Vamp (in), Voff (out)

### Nets
5V: C1.2 C4.2 P1#2.2 R7#2.2 U1.5(VCC) U2.2(D) U2.7(~{PR}) U2.8(VCC) ; port 5V
GND: C1.1 C2.2 C3.2 C4.1 D3.1(A) D4.1(A) D5#2.1(A) R3.2 R4.2 R5.2 R6.2 R9.1 R10#2.1 U1.2(GND) U2.4(GND)
A4WPMode: C3.1 D4.3(K) R1.1 R6.1 U1.6(I2) ; port A4WPMode
Nclr: U2.5(Q) ; port Nclr
QiMode: C2.1 D3.3(K) R2.1 R5.1 U1.1(I1) U1.3(I0) ; port QiMode
Vamp: R8.2 ; port Vamp
Voff: U1.4(Y) U2.1(CLK) ; port Voff
NetD1_1: D1.1(A) P1#2.1 R1.2
NetD1_2: D1.2(K) R3.1
NetD2_1: D2.1(A) P1#2.3 R2.2
NetD2_2: D2.2(K) R4.1
NetD5#2_3: D5#2.3(K) R8.1 R9.2 U3#2.5
NetR7#2_1: R7#2.1 R10#2.2 U3#2.6
NetU2_6: U2.6(~{CLR}) U3#2.7

Not connected (* = marked no-connect by the designer): U2 3(~{Q})

### Library data of the parts
C1-C4 = CAP1: Capacitor
D1 D2 = LED0: Typical INFRARED GaAs LED; Published: 8-Jun-2000; LatestRevisionDate: 08-Jul-2005; LatestRevisionNote: Mech Layer 1 removed.; PackageReference: LED-0; Publisher: Altium Limited; PackageDescription: LED; 2 Leads
D3 D4 D5#2 = Diode BAS70: Silicon AF Schottky Diode for High-Speed Switching; pin to pad: 3>2; Note: Pin 2 is not connected and not drawn.; Published: 21-Mar-2003; LatestRevisionDate: 29-May-2009; LatestRevisionNote: IPC-7351 Footprint Added.; DatasheetVersion: Oct-1999; PackageVersion: Sep-2001; PackageReference: SOT-23; Publisher: Altium Limited; PackageDescription: 3-Pin SOT-23 Package 0.95 mm Pitch, 2.5 mm Lead Span; ComponentLink1Description: Manufacturer Link; ComponentLink1URL: http://www.infineon.com/; ComponentLink2Description: Datasheet; ComponentLink2URL: http://www.infineon.com/upload/Document/cmc_upload/documents/009/382/bas40_bas140series_1.pdf
P1#2 = Header 3: Header, 3-Pin; LatestRevisionDate: 17-Jul-2002; LatestRevisionNote: Re-released for DXP Platform.; Publisher: Altium Limited
R1-R6 R7#2 R8 R9 R10#2 = Res1: Resistor; Published: 8-Jun-2000; LatestRevisionDate: 17-Jul-2002; LatestRevisionNote: Re-released for DXP Platform.; PackageReference: AXIAL-0.3; Publisher: Altium Limited; PackageDescription: Axial Device, Thru-Hole; 2 Leads; 0.3 in Pin Spacing

## Sheet ControlPower.SchDoc
size A4
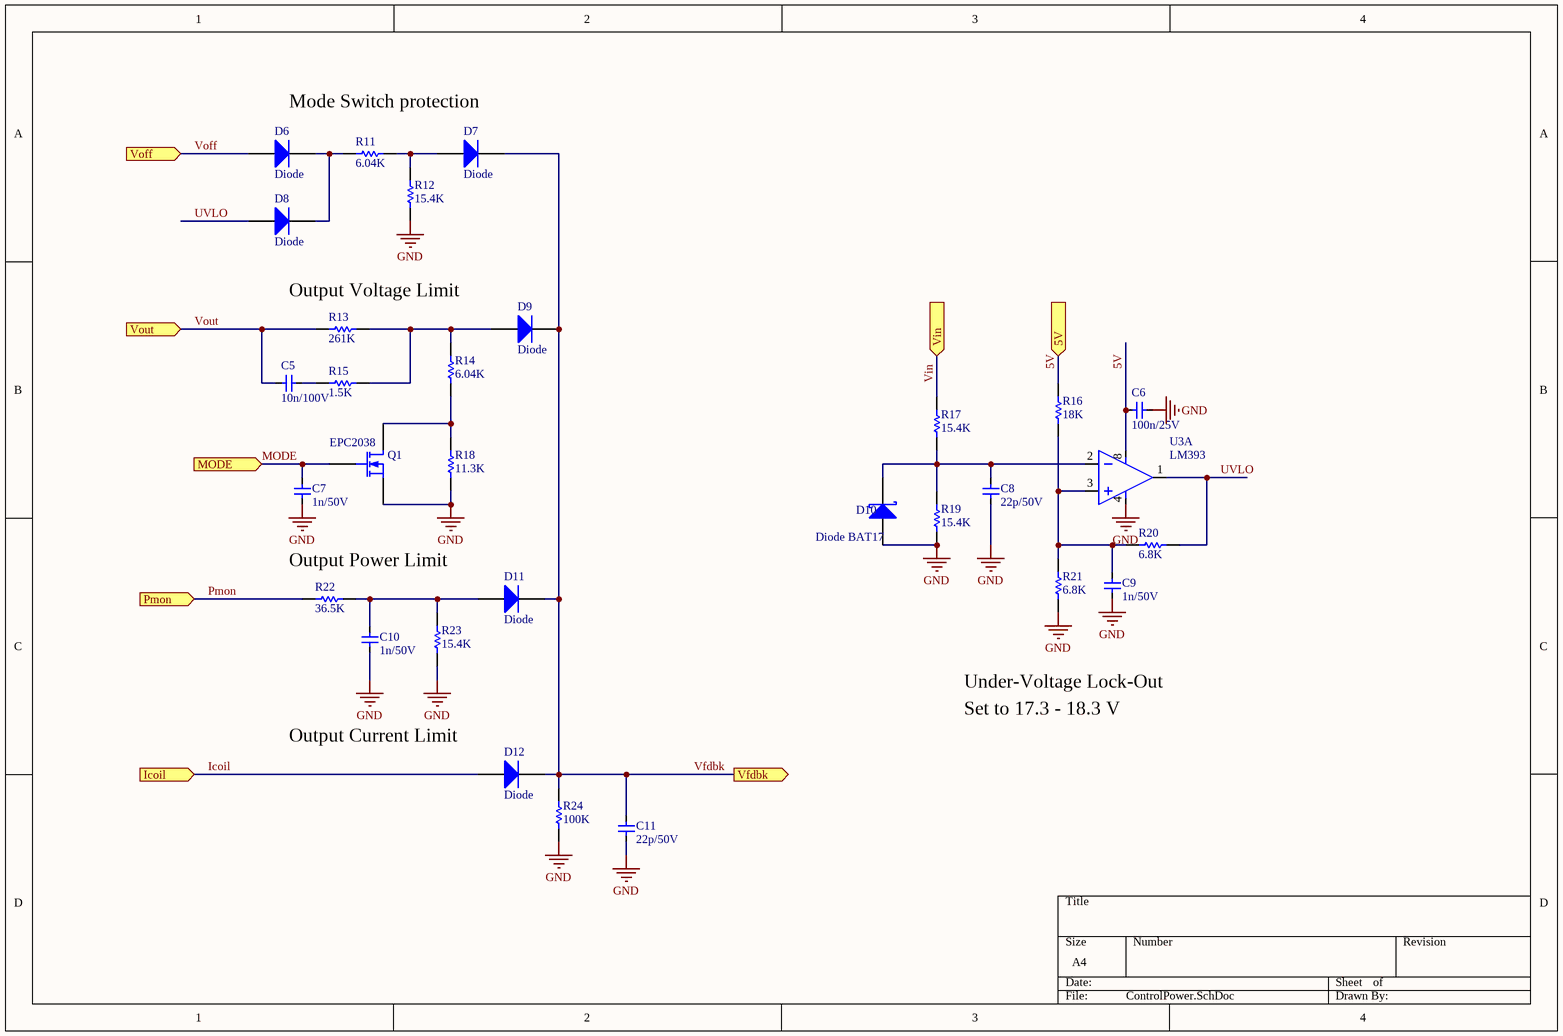
[diagram p6: ControlPower.SchDoc]

### Parts
(Parts that share a designator on the sheet are numbered #1, #2 ... from top to bottom, then left to right.)
C5  10n/100V  [0603]
C6  100n/25V  [0603]
C7  1n/50V  [0603]
C8  22p/50V  [0603]
C9  1n/50V  [0603]
C10  1n/50V  [0603]
C11  22p/50V  [0603]
D6#2  Diode  [SMA]
D7#2  Diode  [SMA]
D8#2  Diode  [SMA]
D9#2  Diode  [SMA]
D10#2  Diode BAT17  [SMA]
D11  Diode  [SMA]
D12  Diode  [SMA]
Q1  EPC2038  [BGA100P9X9-81A]
R11#2  value 6.04K  [0603]  (hidden comment: Res1)
R12  value 15.4K  [0603]  (hidden comment: Res1)
R13#2  value 261K  [0603]  (hidden comment: Res1)
R14#2  value 6.04K  [0603]  (hidden comment: Res1)
R15#2  value 1.5K  [0603]  (hidden comment: Res1)
R16#2  value 18K  [0603]  (hidden comment: Res1)
R17#2  value 15.4K  [0603]  (hidden comment: Res1)
R18#2  value 11.3K  [0603]  (hidden comment: Res1)
R19#2  value 15.4K  [0603]  (hidden comment: Res1)
R20#2  value 6.8K  [0603]  (hidden comment: Res1)
R21#2  value 6.8K  [0603]  (hidden comment: Res1)
R22#2  value 36.5K  [0603]  (hidden comment: Res1)
R23#2  value 15.4K  [0603]  (hidden comment: Res1)
R24#2  value 100K  [0603]  (hidden comment: Res1)
U3#2  LM393  [SO8_L]  (part A of 2)

### Ports
5V (in), Icoil (in), MODE (in), Pmon (in), Vfdbk (out), Vin (in), Voff (in), Vout (in)

### Nets
5V: C6.1 R16#2.1 U3#2.8(gnd) ; port 5V
GND: C6.2 C7.1 C8.1 C9.1 C10.1 C11.1 D10#2.1(A) Q1.3(S) R12.2 R18#2.2 R19#2.2 R21#2.2 R23#2.2 R24#2.2 U3#2.4(vcc)
Icoil: D12.1(A) ; port Icoil
MODE: C7.2 Q1.2(G) ; port MODE  [project net A4WPMode]
Pmon: R22#2.1 ; port Pmon
UVLO: D8#2.1(A) R20#2.2 U3#2.1
Vfdbk: C11.2 D7#2.2(K) D9#2.2(K) D11.2(K) D12.2(K) R24#2.1 ; port Vfdbk
Vin: R17#2.1 ; port Vin
Voff: D6#2.1(A) ; port Voff
Vout: C5.1 R13#2.2 ; port Vout
NetC5_2: C5.2 R15#2.2
NetC8_2: C8.2 D10#2.3(K) R17#2.2 R19#2.1 U3#2.2
NetC9_2: C9.2 R16#2.2 R20#2.1 R21#2.1 U3#2.3
NetC10_2: C10.2 D11.1(A) R22#2.2 R23#2.1
NetD6#2_2: D6#2.2(K) D8#2.2(K) R11#2.2
NetD7#2_1: D7#2.1(A) R11#2.1 R12.1
NetD9#2_1: D9#2.1(A) R13#2.1 R14#2.1 R15#2.1
NetQ1_1: Q1.1(D) R14#2.2 R18#2.1

### Notes on the sheet
- Mode Switch protection
- Output Voltage Limit
- (near R22#2) Output Power Limit
- Under-Voltage Lock-Out
- Set to 17.3 - 18.3 V
- (near D12) Output Current Limit

### Library data of the parts
C5-C11 = CAP1: Capacitor
D6#2 D7#2 D8#2 D9#2 D11 D12 = Diode: Default Diode; Published: 8-Jun-2000; LatestRevisionDate: 17-Jul-2002; LatestRevisionNote: Re-released for DXP Platform.; PackageVersion: Sep-1996; PackageReference: SMC; Publisher: Altium Limited; PackageDescription: DO-214-AB/SMC; 2 C-Bend Leads; Body 7.9 x 5.9 mm, inc. leads (LxW); Code_JEDEC: DO-214-AB
D10#2 = Diode BAT17: Silicon RF Schottky Diode for Mixer Applications in the VHF/UHF Range; pin to pad: 3>2; Note: Pin 2 is not connected and not drawn.; Published: 21-Mar-2003; LatestRevisionDate: 29-May-2009; LatestRevisionNote: IPC-7351 Footprint Added.; DatasheetVersion: Oct-1999; PackageVersion: Sep-2001; PackageReference: SOT-23; Publisher: Altium Limited; PackageDescription: 3-Pin SOT-23 Package 0.95 mm Pitch, 2.5 mm Lead Span; ComponentLink1Description: Manufacturer Link; ComponentLink1URL: http://www.infineon.com/; ComponentLink2Description: Datasheet; ComponentLink2URL: http://www.infineon.com/upload/Document/cmc_upload/documents/009/363/bat17series.pdf
Q1 = MOSFET-N: N-Channel MOSFET; Published: 8-Jun-2000; LatestRevisionDate: 17-Jul-2002; LatestRevisionNote: Re-released for DXP Platform.; PackageVersion: 1995/1996; PackageReference: E3; Publisher: Altium Limited; PackageDescription: TO, Flat Index; 3 In-Line, Axial Leads; Body Dia. 4.6mm; Lead Dia. 0.5 mm (max)
R11#2 R12 R13#2 R14#2 R15#2 R16#2 R17#2 R18#2 R19#2 R20#2 R21#2 R22#2 R23#2 R24#2 = Res1: Resistor; Published: 8-Jun-2000; LatestRevisionDate: 17-Jul-2002; LatestRevisionNote: Re-released for DXP Platform.; PackageReference: AXIAL-0.3; Publisher: Altium Limited; PackageDescription: Axial Device, Thru-Hole; 2 Leads; 0.3 in Pin Spacing

## Sheet MeasurevoltageCurrent .SchDoc
size A4
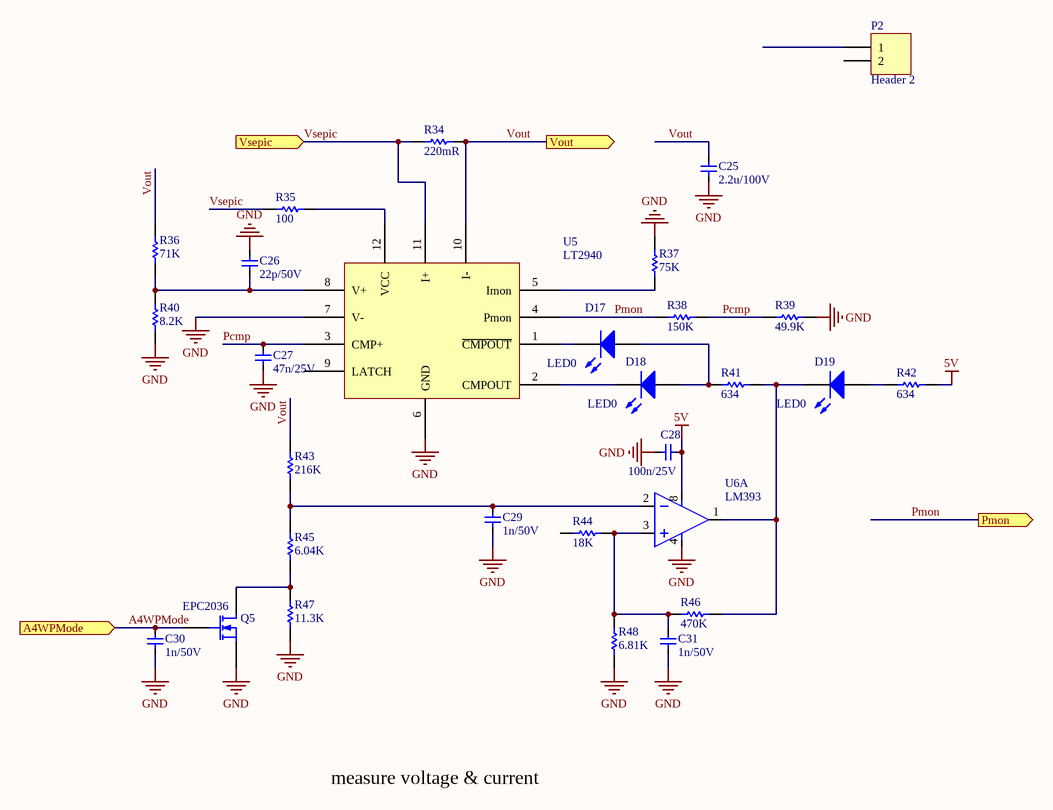
[diagram p7: MeasurevoltageCurrent .SchDoc]

### Parts
(Parts that share a designator on the sheet are numbered #1, #2 ... from top to bottom, then left to right.)
C25#2  2.2u/100V  [0603]
C26#2  22p/50V  [0603]
C27  47n/25V  [0603]
C28  100n/25V  [0603]
C29  1n/50V  [0603]
C30  1n/50V  [0603]
C31  1n/50V  [0603]
D17  LED0  [LED0805]
D18  LED0  [LED0805]
D19  LED0  [LED0805]
P2#2  Header 2  [HDR1X2]
Q5#2  EPC2036  [E3]
R34#2  value 220mR  [0603]  (hidden comment: Res1)
R35#2  value 100  [0603]  (hidden comment: Res1)
R36  value 71K  [0603]  (hidden comment: Res1)
R37  value 75K  [0603]  (hidden comment: Res1)
R38  value 150K  [0603]  (hidden comment: Res1)
R39  value 49.9K  [0603]  (hidden comment: Res1)
R40  value 8.2K  [0603]  (hidden comment: Res1)
R41  value 634  [0603]  (hidden comment: Res1)
R42  value 634  [0603]  (hidden comment: Res1)
R43  value 216K  [0603]  (hidden comment: Res1)
R44  value 18K  [0603]  (hidden comment: Res1)
R45  value 6.04K  [0603]  (hidden comment: Res1)
R46  value 470K  [0603]  (hidden comment: Res1)
R47  value 11.3K  [0603]  (hidden comment: Res1)
R48  value 6.81K  [0603]  (hidden comment: Res1)
U5#2  LT2940
U6#2  LM393  [SO8_L]  (part A of 2)

### Ports
A4WPMode (in), Pmon (out), Vout (out), Vsepic (in)

### Nets
5V: C28.1 R42.2 U6#2.8(gnd)
GND: C25#2.1 C26#2.1 C27.2 C28.2 C29.2 C30.2 C31.2 Q5#2.3(S) R37.1 R39.2 R40.1 R47.1 R48.1 U5#2.6(GND) U5#2.7(V-) U6#2.4(vcc)
A4WPMode: C30.1 Q5#2.2(G) ; port A4WPMode
Pcmp: C27.1 R38.2 R39.1 U5#2.3(CMP+)
Pmon: R38.1 U5#2.4(Pmon) ; port Pmon
Vout: C25#2.2 R34#2.1 R36.2 R43.2 U5#2.10(I-) ; port Vout
Vsepic: R34#2.2 R35#2.2 U5#2.11(I+) ; port Vsepic
NetC26#2_2: C26#2.2 R36.1 R40.2 U5#2.8(V+)
NetC29_1: C29.1 R43.1 R45.2 U6#2.2
NetC31_1: C31.1 R44.2 R46.1 R48.2 U6#2.3
NetD17_1: D17.1(A) D18.1(A) R41.1
NetD17_2: D17.2(K) U5#2.1(~{CMPOUT})
NetD18_2: D18.2(K) U5#2.2(CMPOUT)
NetD19_1: D19.1(A) R42.1
NetD19_2: D19.2(K) R41.2 R46.2 U6#2.1
NetQ5#2_1: Q5#2.1(D) R45.1 R47.2
NetR35#2_1: R35#2.1 U5#2.12(VCC)
NetR37_2: R37.2 U5#2.5(Imon)

Not connected (* = marked no-connect by the designer): P2#2 1 2; R44 1; U5#2 9(LATCH)

### Notes on the sheet
- measure voltage & current

### Library data of the parts
C25#2 C26#2 C27-C31 = CAP1: Capacitor
D17-D19 = LED0: Typical INFRARED GaAs LED; Published: 8-Jun-2000; LatestRevisionDate: 08-Jul-2005; LatestRevisionNote: Mech Layer 1 removed.; PackageReference: LED-0; Publisher: Altium Limited; PackageDescription: LED; 2 Leads
P2#2 = Header 2: Header, 2-Pin; LatestRevisionDate: 17-Jul-2002; LatestRevisionNote: Re-released for DXP Platform.; Publisher: Altium Limited
Q5#2 = MOSFET-N: N-Channel MOSFET; Published: 8-Jun-2000; LatestRevisionDate: 17-Jul-2002; LatestRevisionNote: Re-released for DXP Platform.; PackageVersion: 1995/1996; PackageReference: E3; Publisher: Altium Limited; PackageDescription: TO, Flat Index; 3 In-Line, Axial Leads; Body Dia. 4.6mm; Lead Dia. 0.5 mm (max)
R34#2 R35#2 R36-R48 = Res1: Resistor; Published: 8-Jun-2000; LatestRevisionDate: 17-Jul-2002; LatestRevisionNote: Re-released for DXP Platform.; PackageReference: AXIAL-0.3; Publisher: Altium Limited; PackageDescription: Axial Device, Thru-Hole; 2 Leads; 0.3 in Pin Spacing

## Nets that join several sheets
5V: PowerSupport (7 pins), ControlManage (8 pins), ControlPower (C6.1 R16#2.1 U3#2.8), MeasurevoltageCurrent  (C28.1 R42.2 U6#2.8)
GND: Resonance-AA0 (14 pins), UR1 (13 pins), UR2 (13 pins), Oscillating (20 pins), top (D28.1 P8.1), PowerSupport (19 pins), ControlManage (15 pins), ControlPower (15 pins), MeasurevoltageCurrent  (16 pins)
5V: Resonance-AA0 (P5.7), UR1 (C1_UR1.1 D4_UR1.1 Q2_UR1.1), UR2 (C1_UR2.1 D4_UR2.1 Q2_UR2.1), Oscillating (12 pins)
A4WPMode: Resonance-AA0 (P5.5 Q6#1.2 Q8.2), Oscillating (U4.6)
A4WPMode: ControlManage (5 pins), ControlPower (C7.2 Q1.2)
H_Sig1: UR1 (C12_UR1.1 U1_UR1.6), Oscillating (D5#1.1 R10#1.2 R10#1.3 R11#1.1)
H_Sig2: UR2 (C12_UR2.1 U1_UR2.6), Oscillating (D8#1.1 R15#1.2 R15#1.3 R18#1.1)
L_Sig1: UR1 (C11_UR1.1 U1_UR1.7), Oscillating (D6#1.1 R13#1.2 R13#1.3 R14#1.1)
L_Sig2: UR2 (C11_UR2.1 U1_UR2.7), Oscillating (D9#1.1 R20#1.2 R20#1.3 R21#1.1)
Nclr: Resonance-AA0 (P5.6), Oscillating (P1#1.1)
OUT: Resonance-AA0 (L2#1.2 T1#1.3), UR1 (6 pins)
OUT: Resonance-AA0 (L5.2 R7#1.1), UR2 (6 pins)
Vamp: Resonance-AA0 (P5.3 Q5#1.1 Q7#1.1), UR1 (6 pins), UR2 (6 pins)
Vamp: top (P9.2), ControlManage (R8.2)
Vfdbk: PowerSupport (U14.4), ControlPower (6 pins)
Vin: top (D28.3 P8.2), PowerSupport (8 pins), ControlPower (R17#2.1)
Voff: ControlManage (U1.4 U2.1), ControlPower (D6#2.1)
Vout: top (P9.1), ControlPower (C5.1 R13#2.2)